# Altium schematic sheet Face PCB Power _ I2C.SchDoc
size A
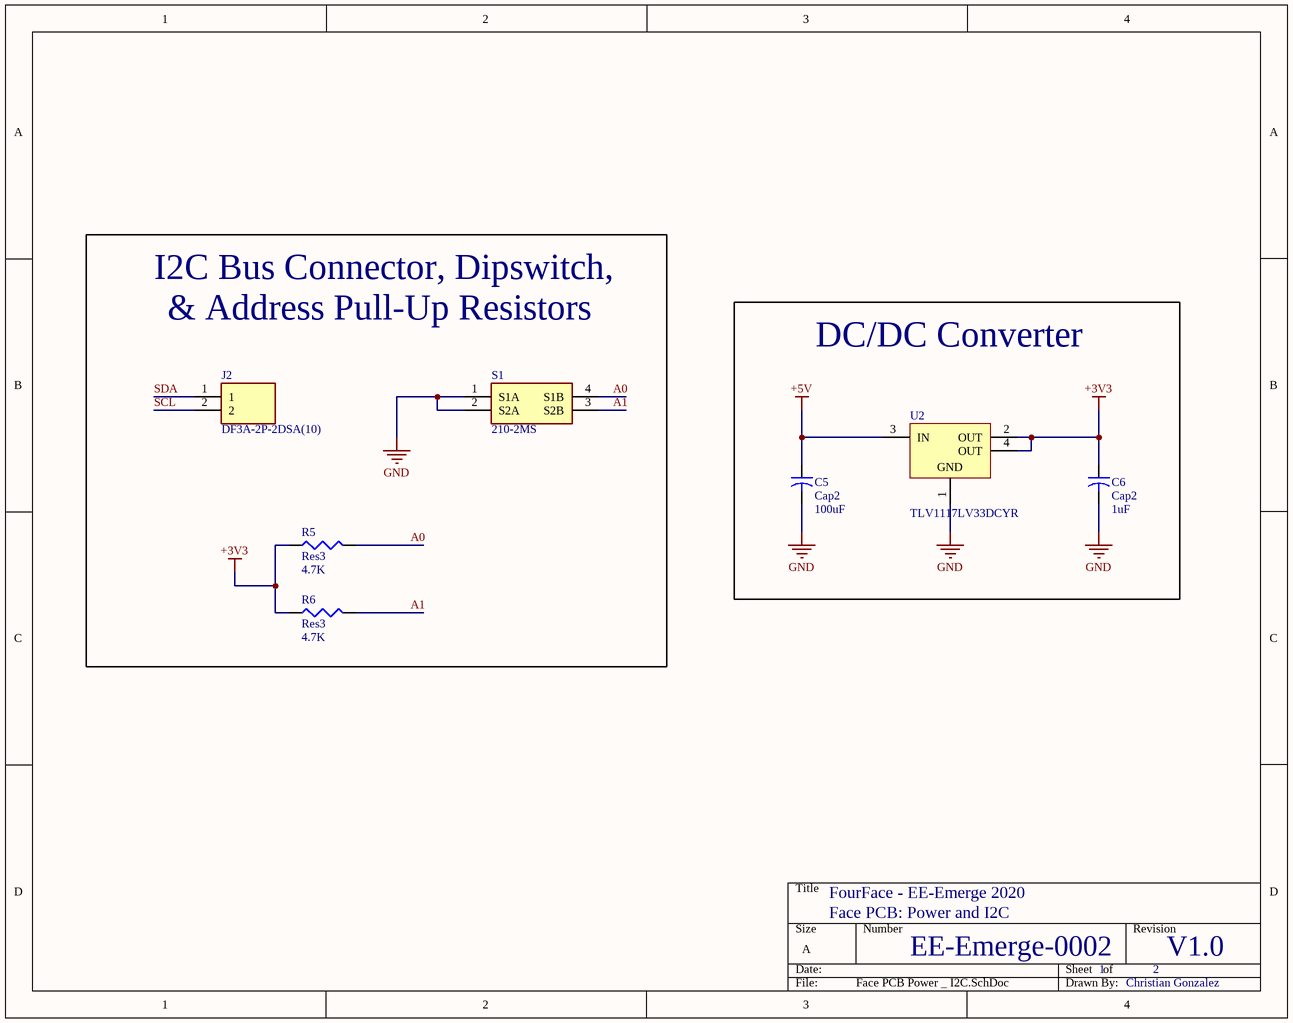
[diagram p0: Face PCB Power _ I2C.SchDoc]

## Parts
C5  Cap2  value 100uF  [C0805]
C6  Cap2  value 1uF  [C0805]
J2  DF3A-2P-2DSA(10)  [SHDR2W50P0X200_1X2_600X500X500P]
R5  Res3  value 4.7K  [6-0805_N]
R6  Res3  value 4.7K  [6-0805_N]
S1  210-2MS  [DIP775W63P254L655H458Q4N]
U2  TLV1117LV33DCYR  [DCY0004A_N]

## Blocks framed on the sheet
DC/DC Converter: C5 C6 U2

## Nets
+3V3: C6.1 R5.1 R6.1 U2.2(OUT) U2.4(OUT)
+5V: C5.1 U2.3(IN)
GND: C5.2 C6.2 S1.1(S1A) S1.2(S2A) U2.1(GND)
A0: R5.2 S1.4(S1B)
A1: R6.2 S1.3(S2B)
SCL: J2.2
SDA: J2.1

## Notes on the sheet
- I2C Bus Connector, Dipswitch,
- & Address Pull-Up Resistors
- FourFace - EE-Emerge 2020
- Face PCB: Power and I2C
- EE-Emerge-0002
- 1
- 2
- V1.0
- Christian Gonzalez

## Library data of the parts
C5 C6 = Cap2: Capacitor; Published: 23-Sep-2002; PackageReference: CAPR5-4X5; Publisher: Altium Limited; PackageDescription: Capacitor; 2 Leads
J2 = DF3A-2P-2DSA(10): Connector; Manufacturer_Name: Hirose; Datasheet Link: https://componentsearchengine.com/Datasheets/1/DF3A-2P-2DSA(10).pdf; Height: 5mm; Manufacturer_Part_Number: DF3A-2P-2DSA(10); Mouser Part Number: 798-DF3A-2P-2DSA10; Mouser Price/Stock: https://www.mouser.com/Search/Refine.aspx?Keyword=798-DF3A-2P-2DSA10
R5 R6 = Res3: Resistor; Published: 8-Jun-2000; LatestRevisionDate: 29-May-2009; LatestRevisionNote: IPC-7351 Footprint Added.; PackageReference: J1-0603; Publisher: Altium Limited; PackageDescription: Chip Resistor
S1 = 210-2MS: Switch; Manufacturer_Name: CTS; Datasheet Link: https://componentsearchengine.com/Datasheets/1/210-2MS.pdf; Height: 4.58mm; Manufacturer_Part_Number: 210-2MS; Mouser Part Number: 774-2102MS; Mouser Price/Stock: https://www.mouser.com/Search/Refine.aspx?Keyword=774-2102MS; RS Part Number: 1774261; RS Price/Stock: http://uk.rs-online.com/web/p/products/1774261
U2 = CMP-0395-00503-2: Single Output LDO, 1 A, Fixed 3.3 V Output, 2 to 5.5 V Input, 4-pin SOT-223 (DCY), -40 to 125 degC, Green (RoHS & no Sb/Br); Manufacturer: Texas Instruments; Vout Adj(Min)(V): 3.3; Vdo(Typ)(mV): 1200; Iq(Typ)(mA): 0.05; Accuracy(%): 2; Iout(Max)(A): 1; SubFamily: Single Channel LDO; Vin(Max)(V): 5.5; PackageReference: DCY0004A; PackageDescription: 4-Pin Plastic Small Outline, Body 3.5 x 6.5 mm, Pitch 2.3 mm; Vout Adj(Max)(V): 3.3; Mounting Technology: Surface Mount; ComponentLink2Description: Datasheet; ComponentLink1Description: Manufacturer URL; PartNumber: TLV1117LV33DCYR; ComponentLink3Description: Package Specification; ComponentLink1URL: http://www.ti.com/; ComponentLink2URL: http://www.ti.com/general/docs/lit/getliterature.tsp?genericPartNumber=TLV1117LV33&fileType=pdf; Fixed Output Options(V): 3.3; PackageVersion: 4202506/B; Vin(Min)(V): 2; DatasheetVersion: SBVS160A; Eco-Plan: Green (RoHS & no Sb/Br); ComponentLink3URL: http://www.ti.com/litv/pdf/mpds094a; Code_JEDEC: TO-261